# EAGLE design main (EAGLE 9.6.2)
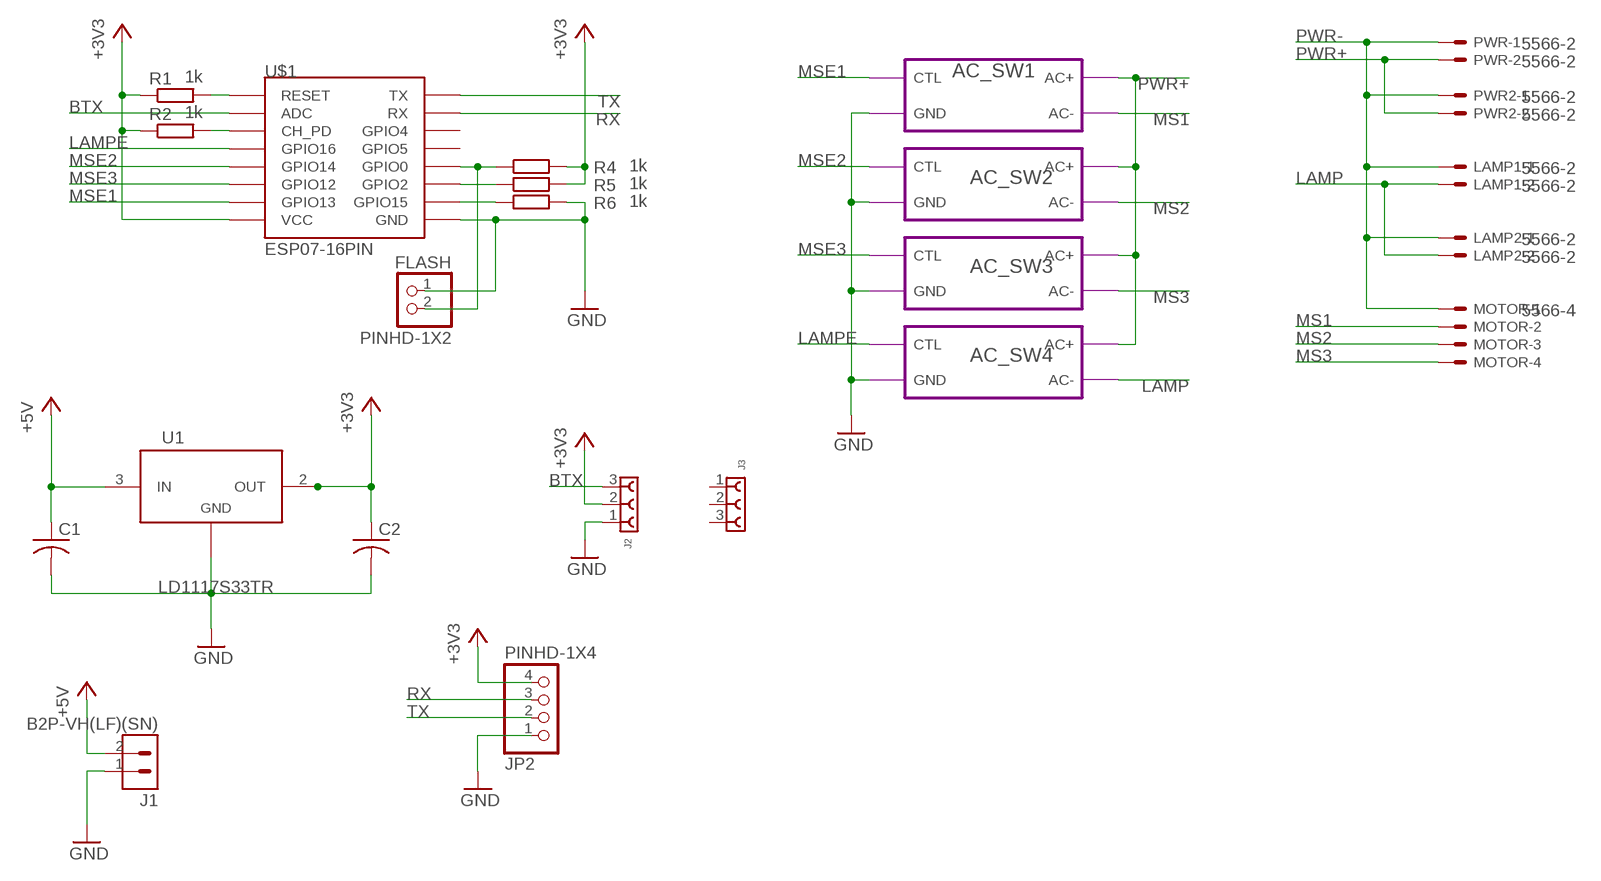
[diagram p0: schematic, sheet 1]

## Parts
C1  C-USC4532  [C4532]
C2  C-USC4532  [C4532]
FLASH  PINHD-1X2  [1X02]
J1  B2P-VH(LF)(SN)  [HDR-02]
J2  6130XX11821_61300311821  [61300311821]
J3  6130XX11821_61300311821  [61300311821]
JP2  PINHD-1X4  [1X04]
LAMP1  5566-2  [5566-2]
LAMP2  5566-2  [5566-2]
MOTOR  5566-4  [5566-4]
PWR  5566-2  [5566-2]
PWR2  5566-2  [5566-2]
R1  1k  R-EU_R1206  [R1206]
R2  1k  R-EU_R1206  [R1206]
R4  1k  R-EU_R1206  [R1206]
R5  1k  R-EU_R1206  [R1206]
R6  1k  R-EU_R1206  [R1206]
U1  LD1117S33TR  [SOT-223]
U$1  ESP07-16PIN  [ESP07-16PIN]

## Module instances
AC_SW1 = AC_SW
AC_SW2 = AC_SW
AC_SW3 = AC_SW
AC_SW4 = AC_SW

## Nets
+3V3 [DC]: C2.1 J2.2 JP2.4 R1.1 R2.1 R4.2 R5.2 U1.2(OUT) U1.4 U$1.VCC
+5V [DC]: C1.1 J1.2 U1.3(IN)
BTX: J2.3 U$1.ADC
GND [DC]: C1.2 C2.2 FLASH.1 J1.1 J2.1 JP2.1 R6.2 U1.1(ADJ/GND) U$1.GND ; port AC_SW1.GND AC_SW4.GND AC_SW3.GND AC_SW2.GND
LAMP: LAMP1.2 LAMP2.2 ; port AC_SW4.AC-
LAMPE: U$1.GPIO16 ; port AC_SW4.CTL
MS1: MOTOR.2 ; port AC_SW1.AC-
MS2: MOTOR.3 ; port AC_SW2.AC-
MS3: MOTOR.4 ; port AC_SW3.AC-
MSE1: U$1.GPIO13 ; port AC_SW1.CTL
MSE2: U$1.GPIO14 ; port AC_SW2.CTL
MSE3: U$1.GPIO12 ; port AC_SW3.CTL
N$1: R1.2 U$1.REST(RESET)
N$2: R2.2 U$1.CH_PD
N$3: R6.1 U$1.GPIO15
N$4: R5.1 U$1.GPIO2
N$5: FLASH.2 R4.1 U$1.GPIO0
PWR+ [AC]: PWR2.2 PWR.2 ; port AC_SW1.AC+ AC_SW2.AC+ AC_SW3.AC+ AC_SW4.AC+
PWR- [AC]: LAMP1.1 LAMP2.1 MOTOR.1 PWR2.1 PWR.1
RX: JP2.2 U$1.RX
TX: JP2.3 U$1.TX
Unconnected: J3.1 J3.2 J3.3 U$1.GPIO4 U$1.GPIO5

## Library data of the parts
C1 C2 = resistor:C-US: CAPACITOR, American symbol
FLASH = Connector:PINHD-1X2: PIN HEADER; CATEGORY: CONNECTOR; SUB-CATEGORY: PIN-HEADER
J1 = Connectors:B2P-VH(LF)(SN): CONN HEADER VERT 2POS 3.96MM Manufacturer's datasheet <http://www.jst-mfg.com/product/pdf/eng/eVH.pdf>; CREATED_BY: PCBLayout.com; DIGIKEY_PART_NUMBER: 455-1639-ND; MANUFACTURER: JST Sales America Inc.; MPN: B2P-VH(LF)(SN)
J2 J3 = Wurth_Connectors_WR-PHD:6130XX11821_61300311821: WR-PHD 2.54 mm Socket Header ARTICLE PROPERTIES: Pins:1;​ 2;​ 3;​ 4;​ 5;​ 6;​ 7;​ 8;​ 9;​ 10;​ 12;​ 13;​ 14;​ 15;​ 16;​ 18;​ 20;​ 22;​ 24;​ 25;​ 32;​ 36;​ 40 KIND PROPERTIES: Pitch：2.54 mm Quality Class:3 as per CECC 75 301-802 Rows：Single Gender：Socket Header;​ Female Type：Straight MATERIAL PROPERTIES: Insulator Material :PBT Insulator Flammability Rating:UL94 V-0 Contact Material:Copper Alloy Contact Plating:Gold Contact Type:Stamped GENERAL INFORMATION Operating Temperature:-40 up to +125 °C Compliance:Lead free / RoHS ELECTRICAL PROPERTIES: Rated Current:3 A IR 1:3 A Withstanding Voltage:500 V (AC) Contact Resistance:20 mΩ RISO:1000 MΩ CERTIFICATION UL Approval:E323964 PACKAGING PROPERTIES Packaging:Tray <https://katalog.we-online.com/media/images/v2/o33218v209%20Family_WR-PHD_613xxx11821.jpg> Details see: https://katalog.we-online.com/en/em/PHD_2_54_SOCKET_HEADER_6130XX11821 Updated by Yingchun,Shan 2019-10-21 2019 (C) Würth Elektronik; DATASHEET-URL: https://katalog.we-online.com/em/datasheet/61300311821.pdf; GENDER: Socket Header; IR: 3A; MATES: WR-PHD 2.54mm SMT Pin Header/THT Angled Pin Header/THT Pin Header; PACKAGING: Tray; PART-NUMBER: 61300311821; PINS: 3; ROWS: Single; TYPE: Straight
JP2 = Connector:PINHD-1X4: PIN HEADER; CATEGORY: CONNECTOR; SUB-CATEGORY: PIN-HEADER
LAMP1 LAMP2 PWR PWR2 = omez-packs:5566-2: Mini FIT connector 2 pol Source: http://www.molex.com; MF: MOLEX; OC_FARNELL: 1822072; OC_NEWARK: unknown
MOTOR = omez-packs:5566-4: Mini FIT connector 4 pol Source: http://www.molex.com; MF: MOLEX; OC_FARNELL: unknown; OC_NEWARK: unknown
R1 R2 R4-R6 = resistor:R-EU_: RESISTOR, European symbol
U1 = IC:LD1117S33TR: IC REG LINEAR 3.3V 800MA SOT223 Manufacturer's datasheet <http://www.st.com/content/ccc/resource/technical/document/datasheet/99/3b/7d/91/91/51/4b/be/CD00000544.pdf/files/CD00000544.pdf/jcr:content/translations/en.CD00000544.pdf>; CREATED_BY: PCBLayout.com; DIGIKEY_PART_NUMBER: 497-1242-2-ND; MANUFACTURER: STMicroelectronics; MPN: LD1117S33TR; PACKAGE: SOT-223
U$1 = esp8266modules:ESP07-16PIN: ESP8266 Wifi module 07 - 16 pins; DIMENSIONS: 22.0 x 16.0 mm; PINS: 16; PITCH: 0.078" / 2 mm

## Module AC_SW
Ports: AC-(in) AC+(in) CTL(in) GND(in)
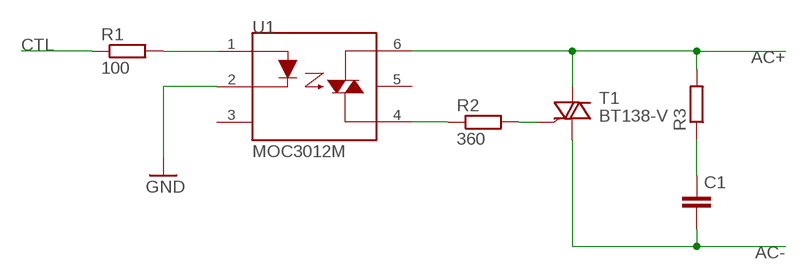
[diagram p1: schematic, module AC_SW, sheet 1]

### Parts
C1  C-EU050-030X075  [C050-030X075]
R1  100  R-EU_R1206  [R1206]
R2  360  R-EU_R1206  [R1206]
R3  R-EU_0204/7  [0204/7]
T1  BT138-V  [TO220BV]
U1  MOC3012M  [MOC3012M]

### Nets
AC+: R3.2 T1.T2(A2) U1.6(MT2)
AC-: C1.2 T1.T1(A1)
CTL: R1.1
GND: U1.2(CATHODE)
N$1: R1.2 U1.1(ANODE)
N$2: R2.1 U1.4(MT1)
N$5: R2.2 T1.G
N$8: C1.1 R3.1
Unconnected: U1.3(NC) U1.5(NC1)

### Library data of the parts
C1 = resistor:C-EU: CAPACITOR, European symbol
R1 R2 = resistor:R-EU_: RESISTOR, European symbol
R3 = resistor:R-EU_: RESISTOR, European symbol; SPICEPREFIX: R
T1 = triac:BT138: TRIAC Source: http://www.semiconductors.philips.com BT138_SERIES_2.pdf
U1 = IC:MOC3012M: OPTOISOLATOR 4.17KV TRIAC 6DIP Manufacturer's datasheet <https://www.onsemi.com/pub/Collateral/MOC3023M-D.PDF>; CREATED_BY: PCBLayout.com; DIGIKEY_PARTNO: MOC3012M-ND; MANUFACTURER: ON Semiconductor; MPN: MOC3012M; PACKAGE: DIP-06

## Net classes
1 AC: width 2.032 mm

## Board
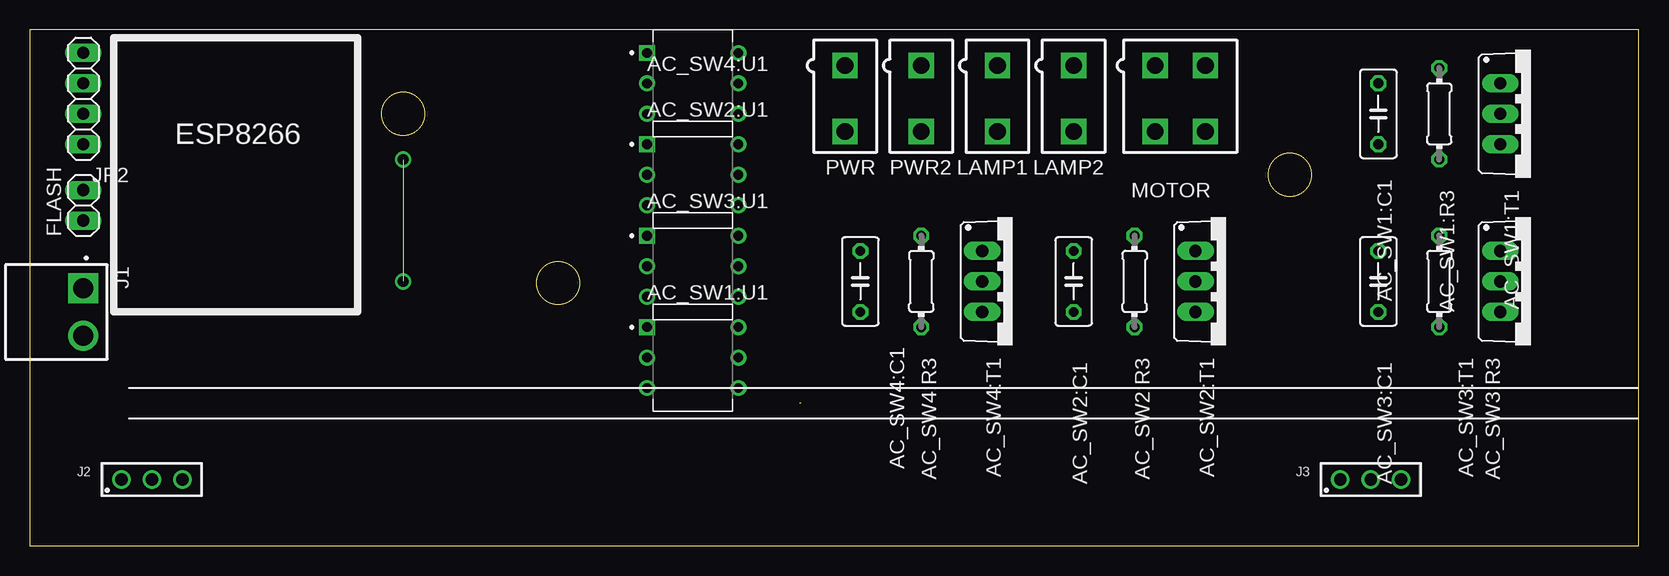
[diagram p2: board, top side]
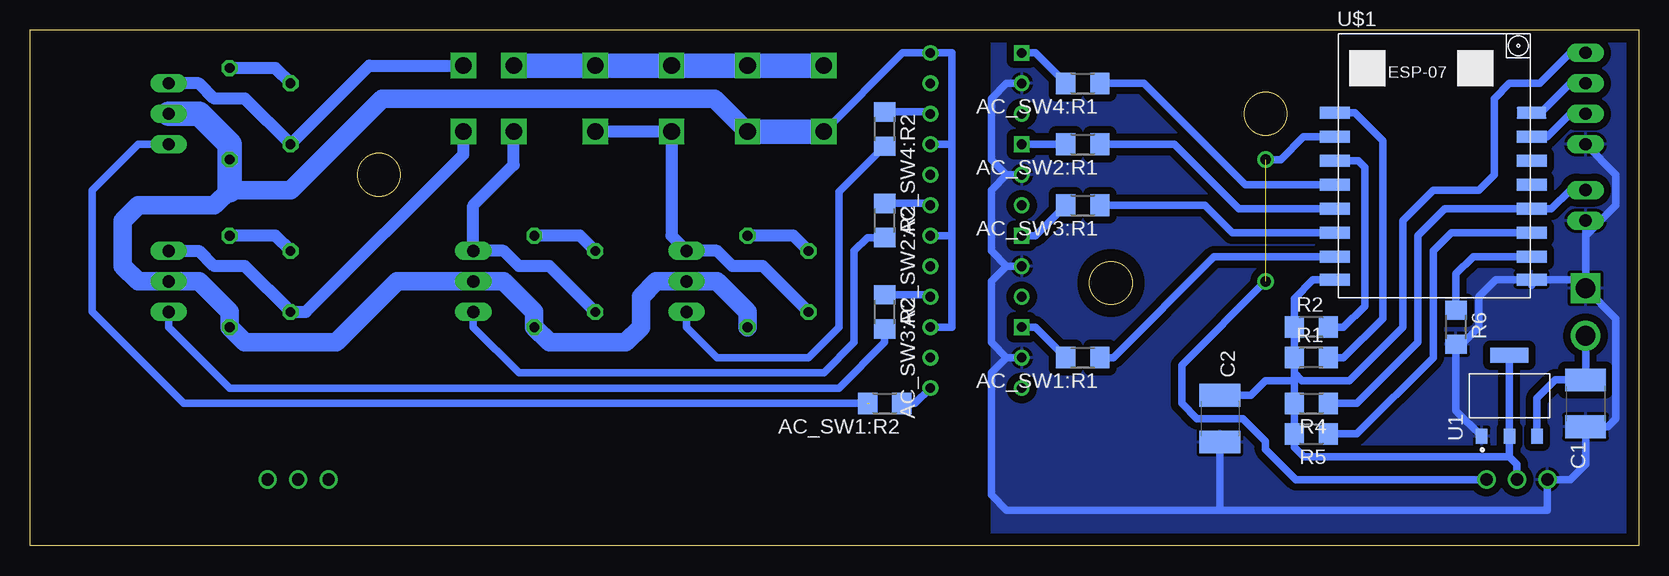
[diagram p3: board, bottom side, seen from below]

Size 134.11 x 42.98 mm. Coordinates in mm from the lower left corner, seen from the top.
Outline: 0,42.98 0,0 134.11,0 134.11,42.98 0,42.98
Outline: circle at 105.03,30.91 radius 1.78
Outline: circle at 44.02,21.89 radius 1.78
Outline: circle at 31.11,35.99 radius 1.78
Copper layers (1*16): Top 0.035mm / dielectric 1.5mm / Bottom 0.035mm
Design rules "default *": minimum track width 6mil, minimum drill 0.35mm, track to track 10mil, track to pad 6mil, pad to pad 6mil, via to via 6mil, smd to smd 6mil, copper to edge 40mil, drill to drill 6mil, minimum pad ring 10mil, minimum via ring 8mil, stop-mask expansion 4mil, vias tented up to drill 0mil, thermal gap 10mil
bKeepout: area 40.9,18.8 to 47.1,25; area 101.9,27.8 to 108.1,34
bRestrict: area 7,37.3 to 27.3,42.3

### Footprints (pad centres in the part's own frame; a part is rotated, then mirrored left to right if it is on the bottom)
C050-030X075 = drill 0.813 octagon: 1 -2.54,0; 2 2.54,0
R1206 = smd 1.6 x 1.803: 1 -1.422,0; 2 1.422,0
0204/7 = drill 0.813 octagon: 1 -3.81,0; 2 3.81,0
TO220BV = drill 1.016 long: G 2.54,-2.54; T1 -2.54,-2.54; T2 0,-2.54
MOC3012M = drill 0.8 square: 1 -3.81,2.54 | drill 0.8: 2 -3.81,0; 3 -3.81,-2.54; 4 3.81,-2.54; 5 3.81,0; 6 3.81,2.54
C4532 = smd 1.9 x 3.4: 1 -1.95,0; 2 1.95,0
1X02 = drill 1.016 long: 1 -1.27,0; 2 1.27,0
HDR-02 = drill 1.65 square: 1 -1.98,0 | drill 1.65: 2 1.98,0
61300311821 = drill 1.02: 1 -2.54,0; 2 0,0; 3 2.54,0
1X04 = drill 1.016 long: 1 -3.81,0; 2 -1.27,0; 3 1.27,0; 4 3.81,0
5566-2 = drill 1.4 square: 1 0,-2.75; 2 0,2.75
5566-4 = drill 1.4 square: 1 2.1,-2.75; 2 -2.1,-2.75; 3 2.1,2.75; 4 -2.1,2.75
SOT-223 = smd 1.26 x 0.96: 1 -3.375,2.3; 2 -3.375,0; 3 -3.375,-2.3 | smd 1.26 x 3.19: 4 3.375,0
ESP07-16PIN = smd 2.5 x 1: ADC -8.2,3.8; CH_PD -8.2,1.8; GND 8.2,-8.105; GPIO0 8.2,-2.2; GPIO2 8.2,-4.2; GPIO4 8.2,1.8; GPIO5 8.2,-0.2; GPIO12 -8.2,-4.2; GPIO13 -8.2,-6.2; GPIO14 -8.2,-2.2; GPIO15 8.2,-6.2; GPIO16 -8.2,-0.2; REST -8.2,5.8; RX 8.2,3.8; TX 8.2,5.8; VCC -8.2,-8.105

### Placement (x,y rotation side)
AC_SW1:C1  [C050-030X075]  112.39,35.99 270 top
AC_SW1:R1  100  [R1206]  46.35,15.67 180 bottom
AC_SW1:R2  360  [R1206]  62.86,11.86 180 bottom
AC_SW1:R3  [0204/7]  117.47,35.99 270 top
AC_SW1:T1  BT138-V  [TO220BV]  125.09,35.99 270 top
AC_SW1:U1  MOC3012M  [MOC3012M]  55.24,15.67 0 top
AC_SW2:C1  [C050-030X075]  87,22.02 270 top
AC_SW2:R1  100  [R1206]  46.35,33.45 180 bottom
AC_SW2:R2  360  [R1206]  62.86,27.1 270 bottom
AC_SW2:R3  [0204/7]  92.08,22.02 270 top
AC_SW2:T1  BT138-V  [TO220BV]  99.69,22.02 270 top
AC_SW2:U1  MOC3012M  [MOC3012M]  55.24,30.91 0 top
AC_SW3:C1  [C050-030X075]  112.39,22.02 270 top
AC_SW3:R1  100  [R1206]  46.35,28.37 180 bottom
AC_SW3:R2  360  [R1206]  62.86,19.48 270 bottom
AC_SW3:R3  [0204/7]  117.47,22.02 270 top
AC_SW3:T1  BT138-V  [TO220BV]  125.09,22.02 270 top
AC_SW3:U1  MOC3012M  [MOC3012M]  55.24,23.29 0 top
AC_SW4:C1  [C050-030X075]  69.22,22.02 270 top
AC_SW4:R1  100  [R1206]  46.35,38.53 180 bottom
AC_SW4:R2  360  [R1206]  62.86,34.72 270 bottom
AC_SW4:R3  [0204/7]  74.3,22.02 270 top
AC_SW4:T1  BT138-V  [TO220BV]  81.91,22.02 270 top
AC_SW4:U1  MOC3012M  [MOC3012M]  55.24,38.53 0 top
C1  4.44,11.86 270 bottom
C2  34.92,10.59 270 bottom
FLASH  4.44,28.37 90 top
J1  4.44,19.48 270 top
J2  10.16,5.51 0 top
J3  111.76,5.51 0 top
JP2  4.44,37.26 90 top
LAMP1  80.64,37.26 180 top
LAMP2  87,37.26 180 top
MOTOR  95.88,37.26 180 top
PWR  67.94,37.26 180 top
PWR2  74.3,37.26 180 top
R1  27.3,15.67 0 bottom
R2  27.3,18.21 0 bottom
R4  27.3,11.86 180 bottom
R5  27.3,9.32 180 bottom
R6  15.24,18.21 270 bottom
U1  10.79,12.5 90 bottom
U$1  17.14,30.28 0 bottom

### Tracks (layer width: path | path; a pad name or v marks a point on that pad's centre or on a via)
+3V3
  Bottom 0.61: R5.2 R4.2 28.73,13.77 | U1.4 U1.2 10.79,7.42 | U$1.VCC 27.15,22.17 28.73,20.6 R2.1 R1.1 28.73,14.4 | JP2.4 5.71,41.07 8.25,38.53 10.79,38.53 12.06,37.26 12.06,30.91 13.33,29.64 17.14,29.64 19.68,27.1 19.68,18.21 24.13,13.77 28.09,13.77 28.73,14.4 | 28.73,14.4 28.73,13.77 | 10.79,7.42 10.16,6.78 J2.2 | 28.73,12.54 R5.2 | C2.1 32.34,12.54 31.11,13.77 28.73,13.77 | R5.2 28.73,8.2 27.94,7.42 10.79,7.42
+5V
  Bottom 0.61: J1.2 C1.1 6.98,13.81 8.49,12.3 U1.3
AC_SW1:N$1
  Bottom 0.61: AC_SW1:R1.2 50.32,18.21 AC_SW1:U1.1
AC_SW1:N$2
  Bottom 0.61: AC_SW1:U1.4 60.33,11.86 AC_SW1:R2.1
AC_SW1:N$5  (1 unrouted)
  Bottom 0.61: AC_SW1:T1.G 125.09,33.45 128.91,29.64 128.91,19.48 121.28,11.86 64.14,11.86
AC_SW1:N$8
  Bottom 1.016: AC_SW1:C1.1 113.66,39.8 AC_SW1:R3.1
AC_SW2:N$1
  Bottom 0.61: AC_SW2:R1.2 AC_SW2:U1.1
AC_SW2:N$2
  Bottom 0.61: AC_SW2:U1.4 59.21,28.52 AC_SW2:R2.1
AC_SW2:N$5
  Bottom 0.61: AC_SW2:R2.2 64.29,25.68 65.41,24.56 65.41,16.94 67.94,14.4 93.34,14.4 97.16,18.21 AC_SW2:T1.G
AC_SW2:N$8
  Bottom 1.016: AC_SW2:C1.1 88.27,25.83 AC_SW2:R3.1
AC_SW3:N$1
  Bottom 0.61: AC_SW3:R1.2 50.32,25.83 AC_SW3:U1.1
AC_SW3:N$2
  Bottom 0.61: AC_SW3:U1.4 59.21,20.9 AC_SW3:R2.1
AC_SW3:N$5
  Bottom 0.61: AC_SW3:R2.2 62.86,16.94 66.67,13.13 117.47,13.13 122.55,18.21 AC_SW3:T1.G
AC_SW3:N$8
  Bottom 1.016: AC_SW3:C1.1 113.66,25.83 AC_SW3:R3.1
AC_SW4:N$1
  Bottom 0.61: AC_SW4:R1.2 50.32,41.07 AC_SW4:U1.1
AC_SW4:N$2
  Bottom 0.61: AC_SW4:U1.4 59.21,36.14 AC_SW4:R2.1
AC_SW4:N$5
  Bottom 0.61: AC_SW4:R2.2 66.67,29.49 66.67,18.21 69.22,15.67 76.83,15.67 79.38,18.21 AC_SW4:T1.G
AC_SW4:N$8
  Bottom 1.016: AC_SW4:C1.1 70.48,25.83 AC_SW4:R3.1
BTX  (via drill 0.9)  (1 unrouted)
  Bottom 0.61: U$1.ADC 27.95,34.08 29.84,32.18 v31.11,32.18 31.25,32.18 | J2.3 28.57,5.51 31.11,8.05 31.11,8.69 33.02,10.59 36.83,10.59 38.1,11.86 38.1,15.04 v31.11,22.02
GND
  Bottom 0.61: AC_SW4:U1.2 52.7,38.53 53.97,37.26 53.97,32.18 52.7,30.91 | 52.7,30.91 AC_SW2:U1.2 | 52.7,30.91 53.97,29.64 53.97,24.56 52.7,23.29 | 52.7,23.29 AC_SW3:U1.2 | 52.7,23.29 53.97,22.02 53.97,16.94 52.7,15.67 | 52.7,15.67 AC_SW1:U1.2 | 52.7,15.67 53.97,14.4 53.97,4.24 52.7,2.97 34.92,2.97 | JP2.1 1.9,30.91 1.9,28.37 4.44,25.83 FLASH.1 J1.1 | 34.92,2.97 7.62,2.97 J2.1 5.71,5.51 4.44,6.78 C1.2 2.58,9.91 1.9,10.59 1.9,18.92 J1.1 | C2.2 34.92,2.97 | R6.2 15,16.68 | J1.1 5.15,22.17 U$1.GND | U$1.GND 8.94,21.71 | R6.2 14.76,16.79 13.33,18.21 13.33,20.75 11.91,22.17 U$1.GND | R6.2 15.24,11.27 U1.1
  pour Bottom (isolate 0.61): 0.63,42.34 0.63,0.43 53.97,0.43 53.97,42.34
LAMP
  Bottom 1.016: LAMP2.2 LAMP1.2 80.64,25.83 AC_SW4:T1.T1 76.83,24.56 75.56,23.29 73.02,23.29 AC_SW4:C1.2
LAMPE
  Bottom 0.61: U$1.GPIO16 32.82,30.08 41.27,38.53 AC_SW4:R1.1
MS1
  Bottom 1.016: MOTOR.2 105.83,40.01 AC_SW1:C1.2 116.2,37.26 118.74,37.26 120.02,38.53 AC_SW1:T1.T1
MS2
  Bottom 1.016: AC_SW2:C1.2 90.8,23.29 93.34,23.29 94.61,24.56 AC_SW2:T1.T1 97.16,28.37 93.78,31.74 MOTOR.3
MS3
  Bottom 1.016: AC_SW3:T1.T1 120.02,24.56 118.74,23.29 116.2,23.29 AC_SW3:C1.2 111.12,19.48 97.98,32.62 MOTOR.4
MSE1
  Bottom 0.61: AC_SW1:R1.1 43.81,15.67 35.41,24.08 U$1.GPIO13
MSE2
  Bottom 0.61: U$1.GPIO14 33.36,28.08 38.73,33.45 AC_SW2:R1.1
MSE3
  Bottom 0.61: AC_SW3:R1.1 36.2,28.37 33.9,26.08 U$1.GPIO12
N$1
  Bottom 0.61: U$1.REST 23.68,36.08 21.36,33.76 21.36,18.92 24.61,15.67 R1.2
N$2
  Bottom 0.61: U$1.CH_PD 23.39,32.08 22.86,31.55 22.86,19.96 24.61,18.21 R2.2
N$3
  Bottom 0.61: 15.14,19.63 R6.1 15.24,22.66 13.82,24.08 U$1.GPIO15
N$4
  Bottom 0.61: R5.1 23.49,9.32 17.14,15.67 17.14,24.56 15.63,26.08 U$1.GPIO2
N$5
  Bottom 0.61: R4.1 23.49,11.86 18.41,16.94 18.41,25.83 16.17,28.08 U$1.GPIO0 7.28,28.08 5.71,29.64 FLASH.2
PWR+
  Bottom 0.61: PWR.2 61.38,41.07 AC_SW4:U1.6 57.28,41.07 57.28,33.45 | AC_SW1:U1.6 57.28,18.21 57.28,25.83 | 57.28,33.45 57.28,25.83 | AC_SW2:U1.6 57.28,33.45 | AC_SW3:U1.6 57.28,25.83
  Bottom 1.524: PWR2.2 77.05,37.26 104.77,37.26 112.39,29.64 117.47,29.64 118.74,28.37 125.09,28.37 126.36,27.1 126.36,23.29 125.09,22.02 AC_SW3:T1.T2 120.02,22.02 117.47,19.48 AC_SW3:R3.2 116.2,16.94 108.58,16.94 103.5,22.02 AC_SW2:T1.T2 94.61,22.02 92.08,19.48 AC_SW2:R3.2 90.8,16.94 84.45,16.94 83.19,18.21 83.19,20.75 81.91,22.02 AC_SW4:T1.T2 76.83,22.02 74.3,19.48 AC_SW4:R3.2
  Bottom 2.032: AC_SW1:T1.T2 120.02,35.99 117.47,33.45 AC_SW1:R3.2 117.47,29.64 | PWR2.2 PWR.2
PWR-
  Bottom 2.032: MOTOR.1 LAMP2.1 LAMP1.1 PWR2.1 PWR.1
RX
  Bottom 0.61: U$1.RX 7.63,34.08 5.71,35.99 JP2.2
TX
  Bottom 0.61: U$1.TX 8.17,36.08 5.71,38.53 JP2.3

### Text on the board
tPlace: ESP8266